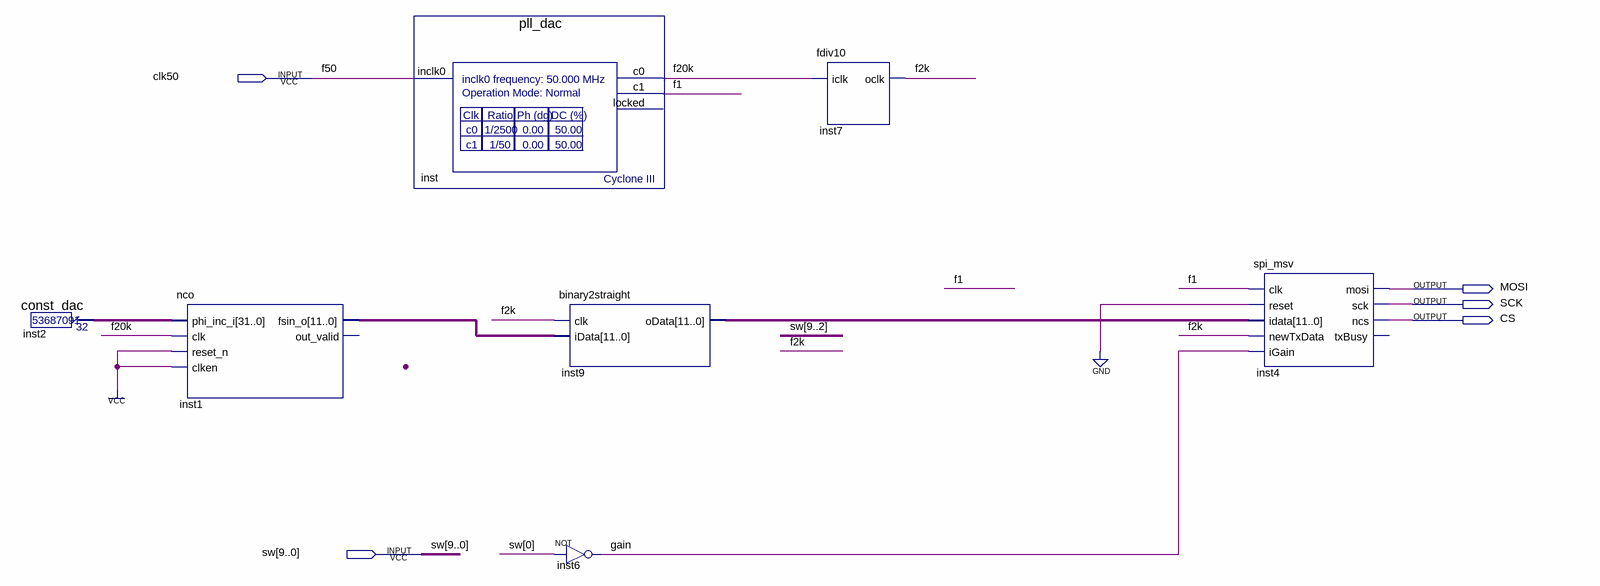
[diagram p0: schematic sheet]
// Quartus schematic dac_test.bdf as structural Verilog: 7 symbols, 5 pins
module dac_test (
  input  clk50,
  input  [9:0] sw,
  output MOSI,
  output SCK,
  output CS
);

  wire f1, f2k, f20k, gain;
  wire [11:0] inst1_fsin_o, inst9_odata;
  wire [31:0] inst2_result;

  const_dac inst2 (.result(inst2_result));
  nco inst1 (
    .phi_inc_i(inst2_result), .clk(f20k), .reset_n(1'b1), .clken(1'b1), .fsin_o(inst1_fsin_o));  // open: out_valid
  pll_dac inst (.inclk0(clk50), .c0(f20k), .c1(f1));  // open: locked
  binary2straight inst9 (.clk(f2k), .iData(inst1_fsin_o), .oData(inst9_odata));
  not inst6 (gain, sw[0]);
  fdiv10 inst7 (.iclk(f20k), .oclk(f2k));
  spi_msv inst4 (
    .clk(f1), .reset(1'b0), .idata(inst9_odata), .newTxData(f2k), .iGain(gain), .mosi(MOSI), .sck(SCK),
    .ncs(CS));  // open: txBusy

  // Other names for the same wires on the sheet: f50 = clk50
endmodule
